# Altium schematic sheet control_logic.SchDoc (part 2 of 2)
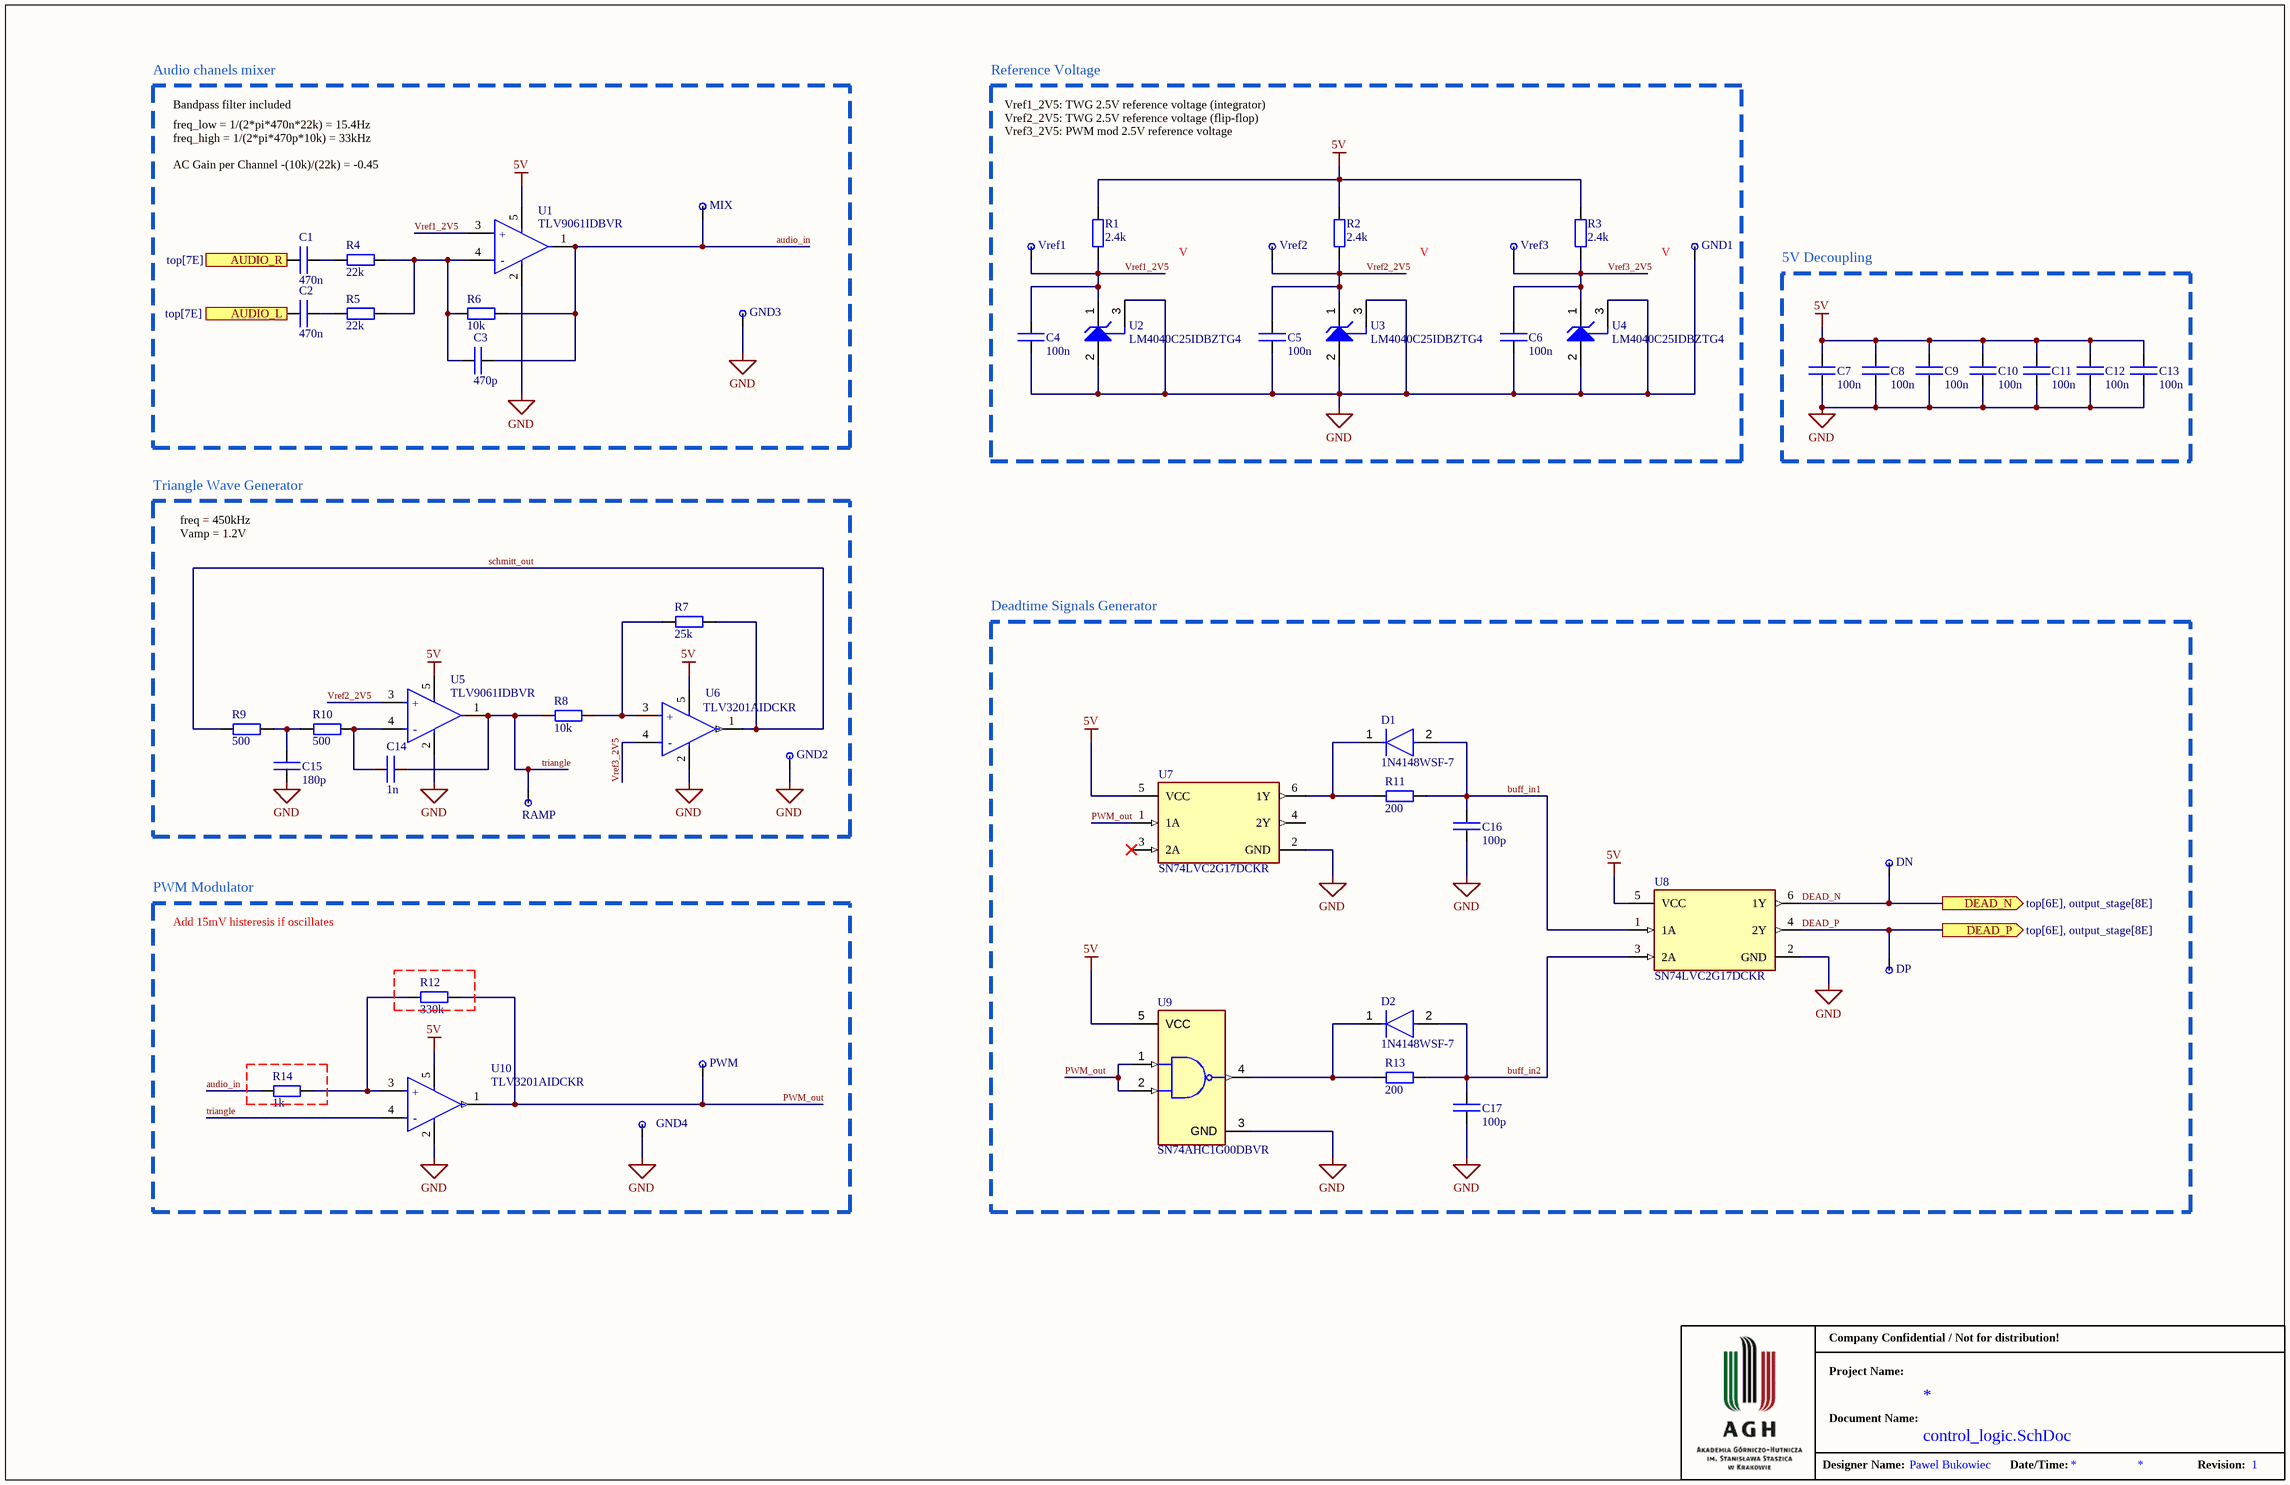
[diagram p1: control_logic.SchDoc]

## Library data of the parts
C1 C2 = Capacitor: Manufacturer: *; Part Number: *; Value: 470n
C3 = Capacitor: Dielectric: C0G; Voltage: 10; Manufacturer: *; Part Number: *; Value: 470p
C4-C13 = Capacitor: Dielectric: X7R; Voltage: 16; Manufacturer: *; Part Number: *; Value: 100n
C14 C15 = Capacitor: Dielectric: C0G; Volatge: 16; Manufacturer: *; Part Number: *
  C14: Value: 1n
  C15: Value: 180p
C16 C17 = Capacitor: Dielectric: C0G; Volatge: 10; Manufacturer: *; Part Number: *; Value: 100p
D1 D2 = 1N4148: DIODE GEN PURP 100V 250MA SOD323; Manufacturer: Diodes Inc.; Value: 1.5pF; Max Surge Forward Current: 0.5A; Peak Reverse Current: 0.5uA; Max Junction Temp: +150°C; Height: 0.75mm; Digikey Description: DIODE GEN PURP 100V 250MA SOD323; Automotive: No; Footprint Url: https://www.diodes.com/assets/Package-Files/SOD323F.pdf; Category: Diode; Manufacturer Part Number: 1N4148WSF-7; Max Repetitive Reverse Voltage: 100V; Lead Free: Yes; Temperature Range High: +150°C; Forward Current: 250mA; Reverse Voltage: 100V; Device Class L3: Rectifier Diodes; ComponentLink2URL: https://www.diodes.com/assets/Datasheets/1N4148WSF.pdf; Package: SOD323F; RoHS: TRUE; Mouser Description: Diodes - General Purpose, Power, Switching 200mW 2pF 75Vrrm 150mA 2A 1VF; Temperature: -55°C to +150°C; Capacitance: 1.5pF; Device Class L2: Diodes; ComponentLink2Description: Datasheet; Device Class L1: Discrete Semiconductors; Octopart: https://octopart.com/1n4148wsf-7-diodes+inc.-33798544; Temperature Range Low: -55°C
DN DP GND1-GND4 MIX PWM RAMP Vref1-Vref3 = TestPoint: Test Point
R1-R14 = Resistor: Manufacturer: *; Part Number: *; ComponentLink1Description: HelpURL; ComponentLink1URL: *
  R1-R3: Value: 2.4k
  R4 R5: Value: 22k
  R6 R8: Value: 10k
  R7: Value: 25k
  R9 R10: Value: 500
  R11 R13: Value: 200
  R12: Value: 330k
  R14: Value: 1k
U1 U5 = TLV9061: IC CMOS 1 CIRCUIT SOT23-5; Gain Bandwidth Product: 10MHz; Operating Supply Current: 538uA; Output Current per Channel: 50mA; Number of Circuits: 1; Input Bias Current: 0.5pA; Input Offset Voltage (Vos): 300uV; Slew Rate: 6.5V/µs; Min Operating Temperature: -40°C; Packaging: Cut Tape; RoHS Compliant: Yes; Mount: Surface Mount; Max Operating Temperature: 125°C; Case/Package: SOT-23-6
U2-U4 = LM4040C25: Precision Micropower Shunt Voltage Reference, 0.5% accuracy, 2.5 V, 15 ppm / degC, 15 mA, -40 to 85 degC, 3-pin SOT-23 (DBZ), Green (RoHS & no Sb/Br); Manufacturer: Texas Instruments; Temp Coeff(Max)(ppm/ degree C): 100; VO(V): 2.5; Rating: Catalog; Min Iz for Regulation(uA): 75; Temp Coeff(Typ)(ppm/ degree C): 15; Initial Accuracy @ 25/deg C(%): 0.5; PartNumber: LM4040C25IDBZTG4; PackageDescription: 3-Pin Plastic Small Outline, Body 2.92 x 1.3 mm, Pitch 0.95 mm; PackageVersion: 4203227/B; ComponentLink3URL: http://www.ti.com/litv/pdf/mpds108a; ComponentLink2URL: http://www.ti.com/general/docs/lit/getliterature.tsp?genericPartNumber=LM4040C25&fileType=pdf; Mounting Technology: Surface Mount; ComponentLink3Description: Package Specification; ComponentLink1URL: http://www.ti.com/; DatasheetVersion: SLOS456K; PackageReference: DBZ3; ComponentLink1Description: Manufacturer URL; Eco-Plan: Green (RoHS & no Sb/Br); SubFamily: Shunt Voltage Reference; Code_JEDEC: TO-236; Iout/Iz(Max)(mA): 15; ComponentLink2Description: Datasheet
U6 U10 = TLV3201: IC COMPARATOR RRI SGL SC70-5; Output Type: PUSH-PULL; Max Supply Current: 40uA; Nominal Supply Current: 50uA; Propagation Delay: 50ns; Max Input Current: 5nA; Input Offset Voltage (Vos): 5mV; Number of Channels: 1; Power Supply Rejection Ratio (PSRR): 85dB; Hysteresis: 1.2mV; Min Supply Voltage: 2.7V; Max Supply Voltage: 5.5V; Response Time: 0.047us; Series: -; Case/Package: SOT-23-5; Packaging: Tape and Reel; Number of Pins: 5; RoHS Compliant: Yes; Min Operating Temperature: -40°C; Mount: Surface Mount; Radiation Hardening: No; Number of Elements: 1; Input Bias Current: 5nA; Lead Free: Lead Free; Max Operating Temperature: 125°C; Supply Current: 50uA; Type: General Purpose; Common Mode Rejection Ratio: 85dB; Package Quantity: 3000; Quiescent Current: 40uA
U7 U8 = SN74LVC2G17DCKR: IC BUF NON-INVERT 5.5V SC70-6; Schmitt Trigger Input: Yes; Number of Inputs: 2; Propagation Delay: 4.3ns; Number of Bits per Element: 1; Logic Function: Schmitt Trigger; Polarity: Non-Inverting; Low Level Output Current: 32mA; High Level Output Current: -32mA; Min Supply Voltage: 1.65V; Nominal Supply Current: 250mA; Quiescent Current: 10uA; Turn-On Delay Time: 9.3ns; Number of Pins: 6; Number of Channels: 2; Length: 2mm; Min Operating Temperature: -40°C; Contact Plating: Gold; Lead Free: Lead Free; Termination: SMD/SMT; Width: 1.25mm; Package Quantity: 1; REACH SVHC: No SVHC; Number of Bits: 2; Max Supply Voltage: 5.5V; Number of Output Lines: 2; Mount: Surface Mount; Number of Circuits: 2; Packaging: Tape and Reel; Case/Package: SC; Number of Input Lines: 2; Number of Gates: 2; RoHS Compliant: Yes; Height: 0.9mm; Max Operating Temperature: 125°C; Number of Elements: 2; Number of Outputs: 2; Radiation Hardening: No
U9 = SN74AHC1G00DBVR: IC GATE NAND 1CH 2-INP SOT23-5; Manufacturer: Texas Instruments; Standoff Height: 0mm; Number Of Outputs: 1; Nominal Supply Current: 1uA; Max Junction Temp: +150°C; Propagation Delay: 5.2ns; Min Supply Voltage: 2V; Max Supply Voltage: 5.5V; Number Of Inputs: 2; Category: IC; Logic Function Desc: NAND; Ambient Temperature Range High: +125°C; Automotive: No; Octopart: https://octopart.com/sn74ahc1g00dbvr-texas+instruments-464400; Device Class L1: Integrated Circuits (ICs); Device Class L2: Logic ICs; RoHS: TRUE; Height: 1.45mm; Digikey Description: IC GATE NAND 1CH 2-INP SOT23-5; Lead Free: Yes; Ambient Temperature Range Low: -40°C; Number Of Circuits: 1; Device Class L3: Logic Gates; Package: DBV0005A; Manufacturer Part Number: SN74AHC1G00DBVR; ComponentLink2URL: https://www.ti.com/lit/ds/symlink/sn74ahc1g00.pdf; Temperature Range Low: -40°C; Temperature: -40°C to +125°C; Temperature Range High: +125°C; ComponentLink2Description: Datasheet